# EAGLE design LevelShifterModule (EAGLE 5.10)
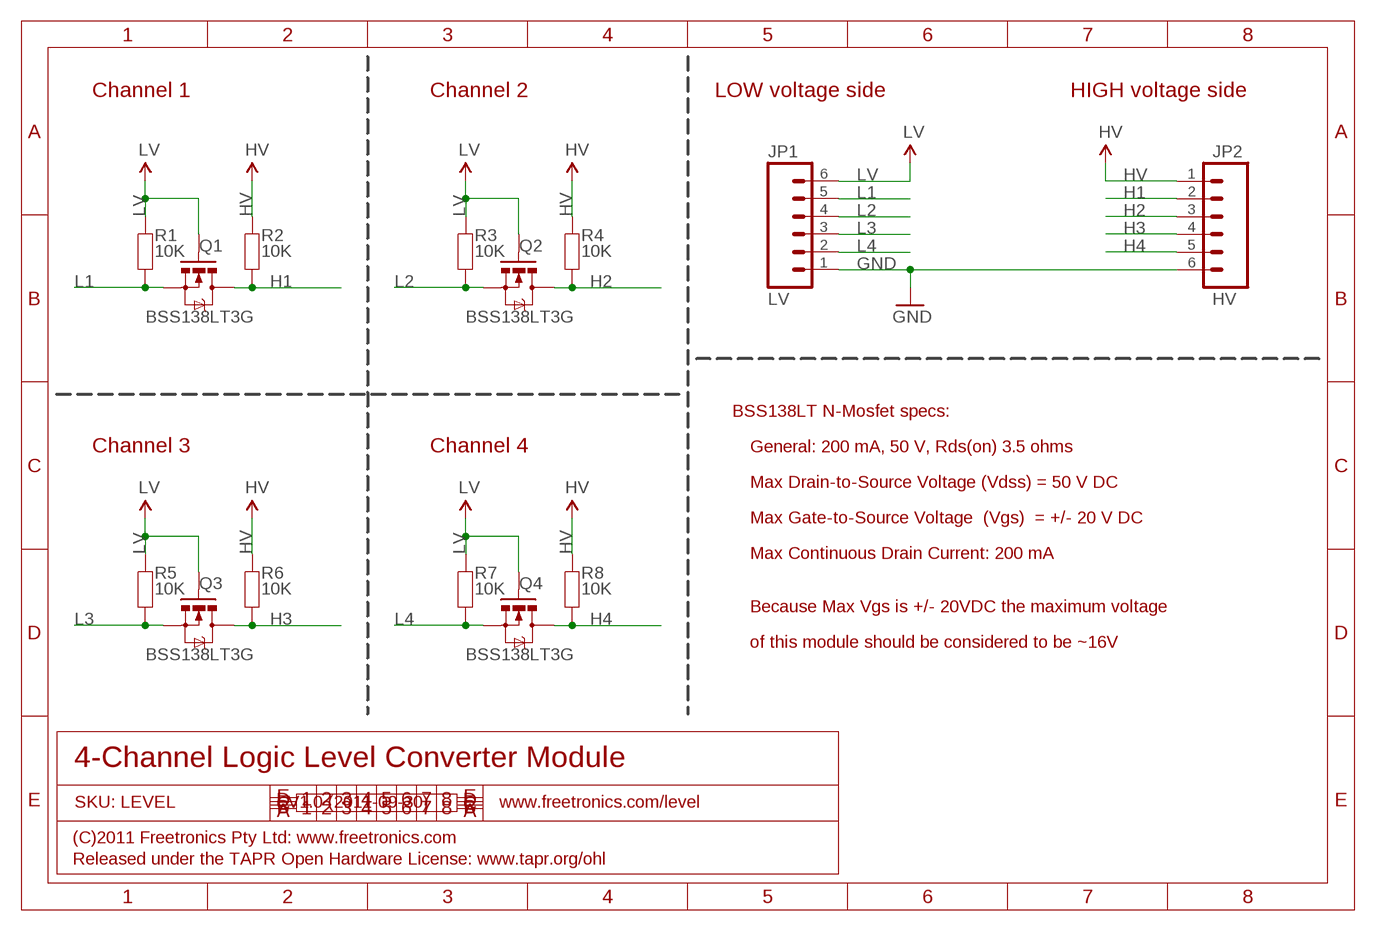
[diagram p0: schematic, sheet 1]

## Parts
JP1  LV  M06SIP  [1X06]
JP2  HV  M06SIP  [1X06]
Q1  BSS138LT3G  MOSFET-NCHANNELSMD  [SOT23-3]
Q2  BSS138LT3G  MOSFET-NCHANNELSMD  [SOT23-3]
Q3  BSS138LT3G  MOSFET-NCHANNELSMD  [SOT23-3]
Q4  BSS138LT3G  MOSFET-NCHANNELSMD  [SOT23-3]
R1  10K  RESISTOR0603  [0603]
R2  10K  RESISTOR0603  [0603]
R3  10K  RESISTOR0603  [0603]
R4  10K  RESISTOR0603  [0603]
R5  10K  RESISTOR0603  [0603]
R6  10K  RESISTOR0603  [0603]
R7  10K  RESISTOR0603  [0603]
R8  10K  RESISTOR0603  [0603]

## Nets
GND: JP1.1 JP2.6
H1: JP2.2 Q1.3(D) R2.1
H2: JP2.3 Q2.3(D) R4.1
H3: JP2.4 Q3.3(D) R6.1
H4: JP2.5 Q4.3(D) R8.1
HV: JP2.1 R2.2 R4.2 R6.2 R8.2
L1: JP1.5 Q1.2(S) R1.1
L2: JP1.4 Q2.2(S) R3.1
L3: JP1.3 Q3.2(S) R5.1
L4: JP1.2 Q4.2(S) R7.1
LV: JP1.6 Q1.1(G) Q2.1(G) Q3.1(G) Q4.1(G) R1.2 R3.2 R5.2 R7.2

## Notes on the sheet
- Channel 1 | Channel 2 | LOW voltage side | HIGH voltage side
- BSS138LT N-Mosfet specs:
- Channel 3 | Channel 4 | General: 200 mA, 50 V, Rds(on) 3.5 ohms
- Max Drain-to-Source Voltage (Vdss) = 50 V DC
- Max Gate-to-Source Voltage  (Vgs)  = +/- 20 V DC
- Max Continuous Drain Current: 200 mA
- Because Max Vgs is +/- 20VDC the maximum voltage
- of this module should be considered to be ~16V
- 4-Channel Logic Level Converter Module
- SKU: LEVEL | V1.0 (2011-09-30) | www.freetronics.com/level
- (C)2011 Freetronics Pty Ltd: www.freetronics.com
- Released under the TAPR Open Hardware License: www.tapr.org/ohl

## Library data of the parts
JP1 JP2 = freetronics-master-v1.1:M06: Header 6 Standard 6-pin 0.1" header. Use with straight break away headers (SKU : PRT-00116), right angle break away headers (PRT-00553), swiss pins (PRT-00743), machine pins (PRT-00117), and female headers (PRT-00115). Molex polarized connector foot print use with SKU : PRT-08094 with associated crimp pins and housings. NOTES ON THE VARIANTS LOCK and LOCK_LONGPADS... This footprint was designed to help hold the alignment of a through-hole component (i.e. 6-pin header) while soldering it into place. You may notice that each hole has been shifted either up or down by 0.005 of an inch from it's more standard position (which is a perfectly straight line). This slight alteration caused the pins (the squares in the middle) to touch the edges of the holes. Because they are alternating, it causes a "brace" to hold the component in place. 0.005 has proven to be the perfect amount of "off-center" position when using our standard breakaway headers. Although looks a little odd when you look at the bare footprint, once you have a header in there, the alteration is very hard to notice. Also, if you push a header all the way into place, it is covered up entirely on the bottom side. This idea of altering the position of holes to aid alignment will be further integrated into the Sparkfun Library for other footprints. It can help hold any component with 3 or more connection pins.
Q1-Q4 = freetronics-master-v1.1:MOSFET-NCHANNEL
R1-R8 = freetronics-master-v1:RESISTOR: Resistor Basic schematic elements and footprints for 0603, 1206, and PTH 1/10th watt (small) resistors.

## Board
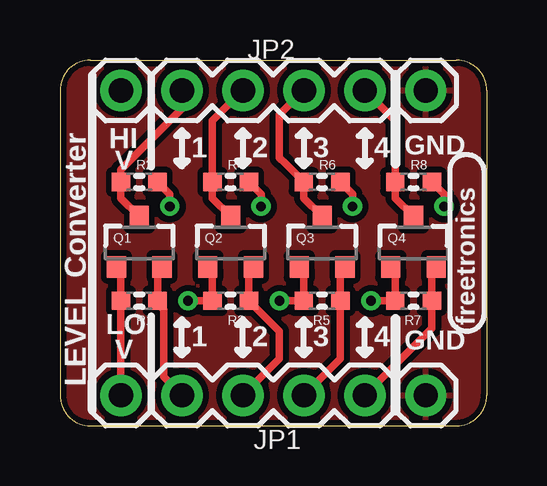
[diagram p1: board, top side]
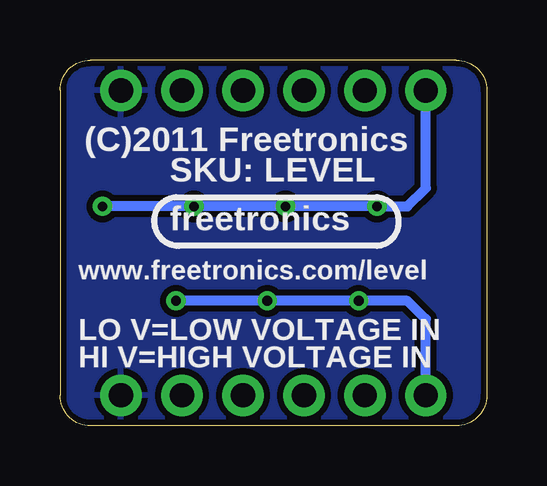
[diagram p2: board, bottom side, seen from below]

Size 17.78 x 15.24 mm. Coordinates in mm from the lower left corner, seen from the top.
Outline: 0,1.27 arc90 1.27,0 16.51,0 arc90 17.78,1.27 17.78,13.97 arc90 16.51,15.24 1.27,15.24 arc90 0,13.97 0,1.27
Copper layers (1*16): Top 0.035mm / dielectric 1.5mm / Bottom 0.035mm
Design rules "default *": minimum track width 8mil, minimum drill 15mil, track to track 10mil, track to pad 10mil, pad to pad 10mil, via to via 10mil, smd to smd 8mil, copper to edge 10mil, drill to drill 8mil, minimum pad ring 14mil, minimum via ring 8mil, stop-mask expansion 4mil, vias tented up to drill 25mil, thermal gap 10mil

### Footprints (pad centres in the part's own frame; a part is rotated, then mirrored left to right if it is on the bottom)
1X06 = drill 1.016 round: 1 0,0; 2 2.54,0; 3 5.08,0; 4 7.62,0; 5 10.16,0; 6 12.7,0
SOT23-3 = smd 0.8 x 0.9: 1 -0.95,-1; 2 0.95,-1; 3 0,1.1
0603 = smd 0.762 x 0.762: 1 -0.762,0; 2 0.762,0

### Placement (x,y rotation side)
JP1  15.24,1.27 180 top
JP2  2.54,13.97 0 top
Q1  3.3,7.62 0 top
Q2  7.11,7.62 0 top
Q3  10.92,7.62 0 top
Q4  14.73,7.62 0 top
R1  3.3,5.21 180 top
R2  3.3,10.16 0 top
R3  7.11,5.21 180 top
R4  7.11,10.16 0 top
R5  10.92,5.21 180 top
R6  10.92,10.16 0 top
R7  14.73,5.21 180 top
R8  14.73,10.16 0 top

### Tracks (layer width: path | path; a pad name or v marks a point on that pad's centre or on a via)
GND
  pour Bottom: 1.27,15.24 arc90 0,13.97 0,1.27 arc90 1.27,0 16.51,0 arc90 17.78,1.27 17.78,13.97 arc90 16.51,15.24
  pour Top: 0,13.97 0,1.27 arc90 1.27,0 16.51,0 arc90 17.78,1.27 17.78,13.97 arc90 16.51,15.24 1.27,15.24 arc90
H1
  Top 0.305: Q1.3 2.54,9.48 R2.1 2.54,10.67 5.08,13.21 JP2.2
H2
  Top 0.305: Q2.3 6.35,9.48 R4.1 6.35,12.7 JP2.3
H3
  Top 0.305: Q3.3 10.16,9.48 R6.1 9.4,10.92 9.14,11.18 9.14,12.95 JP2.4
H4
  Top 0.305: Q4.3 13.97,9.48 R8.1 13.97,12.7 JP2.5
HV  (via drill 0.4, 0.4 pad 0.4)
  Top 0.305: v4.57,9.14 4.57,9.65 R2.2 | v8.38,9.14 8.38,9.65 R4.2 | v12.19,9.14 12.19,9.65 R6.2 | v16,9.14 16,9.65 R8.2
  Bottom 0.406: JP2.1 2.54,9.91 3.3,9.14 v4.57,9.14 v8.38,9.14 v12.19,9.14 v16,9.14
L1
  Top 0.305: R1.1 4.25,5.27 | JP1.5 4.32,2.03 4.32,4.83 4.06,5.08 R1.1 | R1.1 4.06,6.43
  Top 0.406: 4.06,6.43 Q1.2
L2
  Top 0.305: R3.1 8.06,5.27 | JP1.4 9.14,2.79 9.14,3.94 R3.1 | R3.1 7.87,6.43
  Top 0.406: 7.87,6.43 Q2.2
L3
  Top 0.305: R5.1 11.87,5.27 | JP1.3 11.68,2.79 R5.1 | R5.1 11.68,6.43
  Top 0.406: 11.68,6.43 Q3.2
L4
  Top 0.305: R7.1 15.68,5.27 | JP1.2 15.49,4.06 R7.1 | R7.1 15.49,6.43
  Top 0.406: 15.49,6.43 Q4.2
LV  (via drill 0.4)
  Top 0.305: R1.2 2.35,5.27 | v5.33,5.21 R3.2 6.35,6.43 | v9.14,5.21 R5.2 10.16,6.43 | v12.95,5.21 R7.2 13.97,6.43 | JP1.6 R1.2 | R1.2 2.54,6.43
  Top 0.406: 6.35,6.43 Q2.1 | 10.16,6.43 Q3.1 | 2.54,6.43 Q1.1 | 13.97,6.43 Q4.1
  Bottom 0.406: JP1.6 2.54,4.45 3.3,5.21 v5.33,5.21 v9.14,5.21 v12.95,5.21

### Text on the board
tPlace: HI | V | 1 | 2 | 3 | 4 | GND | LO | freetronics | V | 1 | 2 | 3 | 4 | GND | LEVEL Converter
bPlace: (C)2011 Freetronics | SKU: LEVEL | freetronics | www.freetronics.com/level | LO V=LOW VOLTAGE IN | HI V=HIGH VOLTAGE IN